# Altium schematic sheet FQDMDSchematic.SchDoc (part 3 of 3)
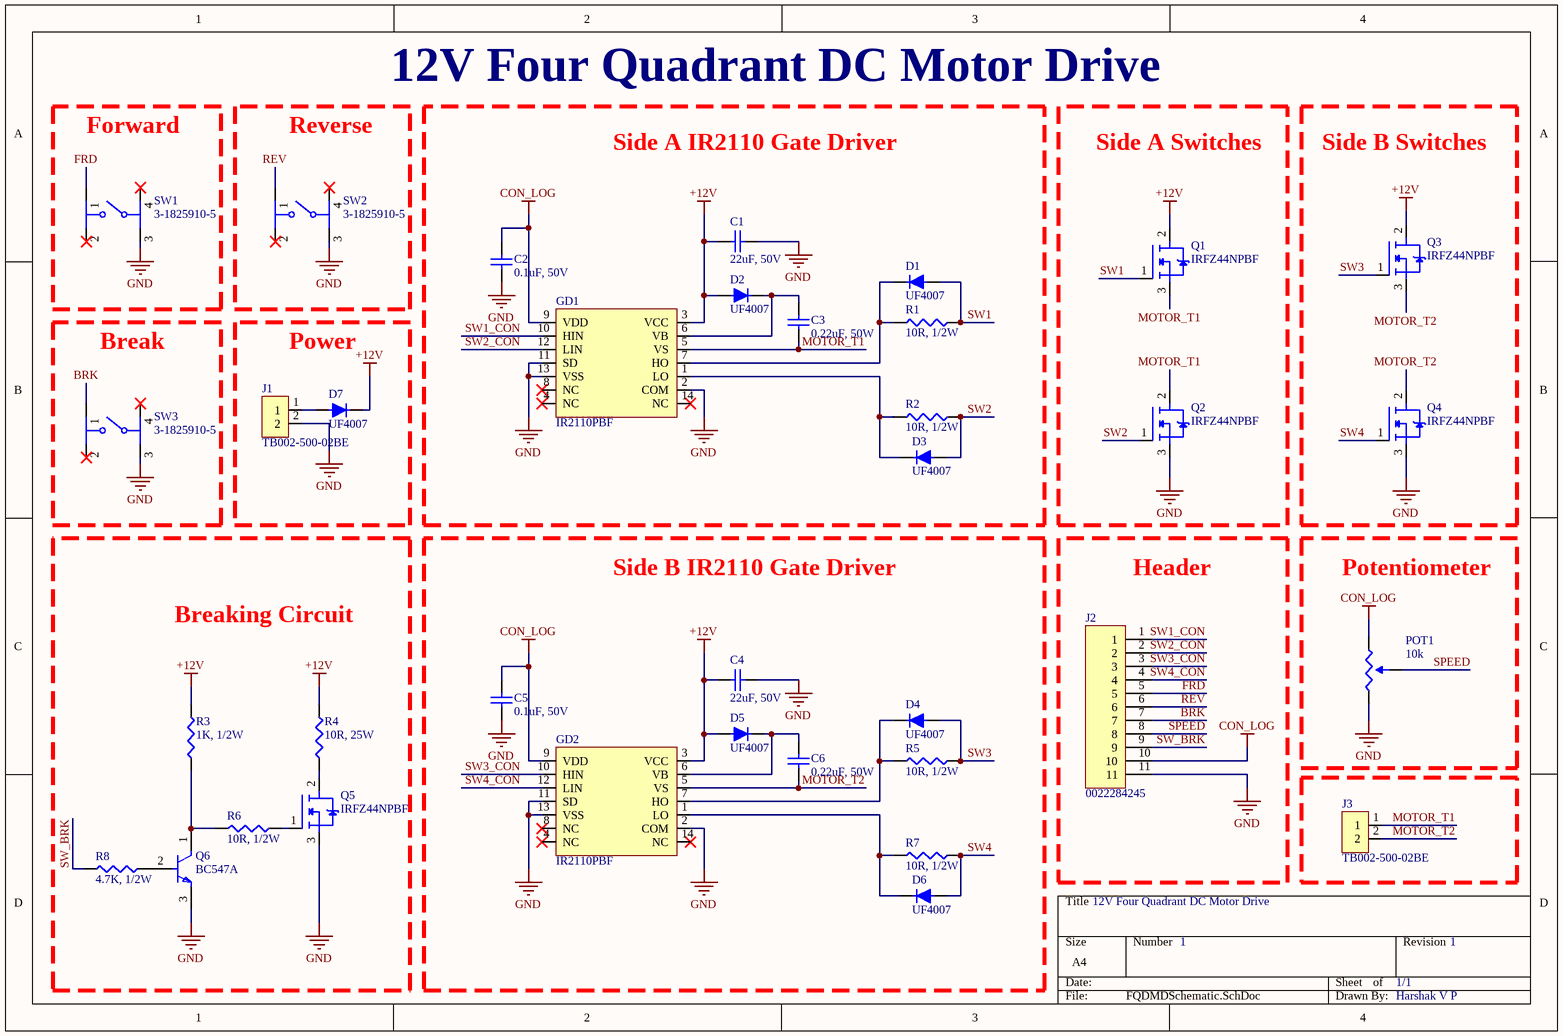
[diagram p2: FQDMDSchematic.SchDoc]

## Library data of the parts (continued)
R4 = KAL25FB10R0: RES CHAS MNT 10 OHM 1% 25W; Manufacturer: Stackpole Electronics; Lead/Base Style: Solder; Value: 10Ω; Temperature Coefficient: 30ppm/°C; Supplier: DigiKey; Supplier Part Number: KAL25FB10R0-ND; Manufacturer Part Number: KAL25FB10R0; RoHS: Compliant; Category: Chassis Mount Resistors; Stock: 500; Pricing: 1=5.22, 10=3.546, 25=3.092, 50=2.8076, 100=2.5658, 250=2.30096, 500=2.1353, 1000=1.99459, 5000=1.75 (USD); Composition: Wirewound; Features: Moisture Resistant; Height: 13.87mm; Housing Material: Aluminium; Length: 26.97mm; Lifecycle Status: Production; Max Operating Temperature: 275°C; Max Power Dissipation: 25W; Min Operating Temperature: -55°C; Mounting Technology: Chassis Mount; Number of Terminals: 2; Packaging: Bulk; Power Rating: 25W; Radiation Hardening: No; REACH SVHC: Yes; Tolerance: 1%; Width: 27.43mm; ComponentLink1URL: https://datasheet.octopart.com:443/KAL25FB10R0-Stackpole-Electronics-datasheet-170576574.pdf?src-supplier=IHS; ComponentLink1Description: https://datasheet.octopart.com:443/KAL25FB10R0-Stackpole-Electronics-datasheet-170576574.pdf?src-supplier=IHS; ComponentLink2URL: https://datasheet.octopart.com:443/KAL25FB10R0-Stackpole-Electronics-datasheet-137738308.pdf?src-supplier=Master+Electronics; ComponentLink2Description: https://datasheet.octopart.com:443/KAL25FB10R0-Stackpole-Electronics-datasheet-137738308.pdf?src-supplier=Master+Electronics; ComponentLink3URL: https://datasheet.octopart.com:443/KAL25FB10R0-Stackpole-Electronics-datasheet-163747744.pdf?src-supplier=Master+Electronics; ComponentLink3Description: https://datasheet.octopart.com:443/KAL25FB10R0-Stackpole-Electronics-datasheet-163747744.pdf?src-supplier=Master+Electronics; ComponentLink4URL: https://datasheet.octopart.com:443/KAL25FB10R0-Stackpole-Electronics-datasheet-32593518.pdf?src-supplier=Stackpole+Electronics; ComponentLink4Description: https://datasheet.octopart.com:443/KAL25FB10R0-Stackpole-Electronics-datasheet-32593518.pdf?src-supplier=Stackpole+Electronics; ComponentLink5URL: https://datasheet.octopart.com:443/KAL25FB10R0-Stackpole-Electronics-datasheet-17020207.pdf?src-supplier=Factory+Futures; ComponentLink5Description: https://datasheet.octopart.com:443/KAL25FB10R0-Stackpole-Electronics-datasheet-17020207.pdf?src-supplier=Factory+Futures; ComponentLink6URL: http://sigma.octopart.com:80/141158211/reach_statement/Stackpole-Electronics-KAL25FB10R0.pdf?src-supplier=Compliance+Statements; ComponentLink6Description: http://sigma.octopart.com:80/141158211/reach_statement/Stackpole-Electronics-KAL25FB10R0.pdf?src-supplier=Compliance+Statements; ComponentLink7URL: http://sigma.octopart.com:80/141158212/rohs_statement/Stackpole-Electronics-KAL25FB10R0.pdf?src-supplier=Compliance+Statements; ComponentLink7Description: http://sigma.octopart.com:80/141158212/rohs_statement/Stackpole-Electronics-KAL25FB10R0.pdf?src-supplier=Compliance+Statements
R8 = CFR-50JT-52-4K7: RES 4.7K OHM 5% 1/2W AXIAL; Manufacturer: Yageo Group; Lead Diameter: 550µm; Power Rating: 500mW; Value: 4.7kΩ; Temperature Coefficient: 350ppm/°C; Working Voltage: 350V; Supplier: DigiKey; Supplier Part Number: 13-CFR-50JT-52-4K7CT-ND; Manufacturer Part Number: CFR-50JT-52-4K7; RoHS: Compliant; Category: Through-Hole Resistors; Stock: 9950; Pricing: 1=0.1, 10=0.05, 25=0.0416, 50=0.0364, 100=0.032, 250=0.0272, 500=0.02418 (USD); Case/Package: Conformal; China RoHS: Compliant; Composition: Carbon Film; Contact Plating: Tin; Country of Origin: Mainland China, Taiwan; Diameter: 3.3mm; Export Control Classification Number (ECCN) Code: EAR99; Harmonized Tariff Schedule (HTS) Code: 8533.10.00.65; Introduction Date: 2007-10-26; Lead Free: Lead Free; Length: 9mm; Lifecycle Status: Production; Max Operating Temperature: 155°C; Military Standard: Not; Min Operating Temperature: -55°C; Mounting Technology: Through Hole; Number of Terminals: 2; Radiation Hardening: No; Ratings: AEC-Q200; REACH SVHC: Yes; Termination: Axial; Tolerance: 5%; ComponentLink1URL: https://datasheet.octopart.com:443/CFR-50JT-52-4K7-Yageo-datasheet-175860721.pdf?src-supplier=Newark; ComponentLink1Description: https://datasheet.octopart.com:443/CFR-50JT-52-4K7-Yageo-datasheet-175860721.pdf?src-supplier=Newark; ComponentLink2URL: https://datasheet.octopart.com:443/CFR-50JT-52-4K7-Yageo-datasheet-12509909.pdf?src-supplier=_legacy+Avnet; ComponentLink2Description: https://datasheet.octopart.com:443/CFR-50JT-52-4K7-Yageo-datasheet-12509909.pdf?src-supplier=_legacy+Avnet; ComponentLink3URL: https://datasheet.octopart.com:443/CFR-50JT-52-4K7-Yageo-Group-datasheet-184398216.pdf?src-supplier=Future+Electronics; ComponentLink3Description: https://datasheet.octopart.com:443/CFR-50JT-52-4K7-Yageo-Group-datasheet-184398216.pdf?src-supplier=Future+Electronics; ComponentLink4URL: https://datasheet.octopart.com:443/CFR-50JT-52-4K7-Yageo-datasheet-165493773.pdf?src-supplier=Future+Electronics; ComponentLink4Description: https://datasheet.octopart.com:443/CFR-50JT-52-4K7-Yageo-datasheet-165493773.pdf?src-supplier=Future+Electronics; ComponentLink5URL: https://datasheet.octopart.com:443/CFR-50JT-52-4K7-Yageo-datasheet-155367611.pdf?src-supplier=Future+Electronics; ComponentLink5Description: https://datasheet.octopart.com:443/CFR-50JT-52-4K7-Yageo-datasheet-155367611.pdf?src-supplier=Future+Electronics; ComponentLink6URL: https://datasheet.octopart.com:443/CFR-50JT-52-4K7-Yageo-datasheet-137875058.pdf?src-supplier=Future+Electronics; ComponentLink6Description: https://datasheet.octopart.com:443/CFR-50JT-52-4K7-Yageo-datasheet-137875058.pdf?src-supplier=Future+Electronics; ComponentLink7URL: https://datasheet.octopart.com:443/CFR-50JT-52-4K7-Yageo-datasheet-28066625.pdf?src-supplier=Future+Electronics; ComponentLink7Description: https://datasheet.octopart.com:443/CFR-50JT-52-4K7-Yageo-datasheet-28066625.pdf?src-supplier=Future+Electronics; ComponentLink8URL: https://datasheet.octopart.com:443/CFR-50JT-52-4K7-Yageo-datasheet-17276704.pdf?src-supplier=Future+Electronics; ComponentLink8Description: https://datasheet.octopart.com:443/CFR-50JT-52-4K7-Yageo-datasheet-17276704.pdf?src-supplier=Future+Electronics; ComponentLink9URL: http://sigma.octopart.com:80/conflict_mineral_statement/Yageo-company-3.pdf?src-supplier=Compliance+Statements; ComponentLink9Description: http://sigma.octopart.com:80/conflict_mineral_statement/Yageo-company-3.pdf?src-supplier=Compliance+Statements; ComponentLink10URL: http://sigma.octopart.com:80/rohs_statement/Yageo-company-2.pdf?src-supplier=Compliance+Statements; ComponentLink10Description: http://sigma.octopart.com:80/rohs_statement/Yageo-company-2.pdf?src-supplier=Compliance+Statements
SW1-SW3 = 3-1825910-5: SWITCH TACTILE SPST-NO 0.05A 24V; Manufacturer: TE Connectivity; Manufacturer Lifecycle Status: ACTIVE; Actuator Length: 4.9mm; Actuator Material: Nylon, Polyamide; Contact Current Rating: 50mA; Contact Resistance: 100mΩ; Electrical Life: 100kcycles; Illumination Type: Illuminated, Non-Illuminated; Number of Positions: 1; Operating Force: 1.568N; Switch Function: Off-Mom; Switch Travel: 250µm; Throw Configuration: SPST; Supplier: DigiKey; Supplier Part Number: 450-1644-ND; Manufacturer Part Number: 3-1825910-5; RoHS: Compliant; Category: Pushbutton Switches; Stock: 31248; Pricing: 1=0.16, 10=0.144, 25=0.1348, 100=0.1213, 250=0.1126, 750=0.10273, 1500=0.09697, 3000=0.09163, 5250=0.08765 (USD); China RoHS: Compliant; Color: Black; Contact Material: Silver; Contact Plating: Silver; Current Rating: 50mA; Export Control Classification Number (ECCN) Code: EAR99; ELV: Compliant; Height: 3.61mm; Housing Material: Nylon; Harmonized Tariff Schedule (HTS) Code: 8536.50.90.40; Introduction Date: 2008-01-30; Lead Free: Lead Free; Length: 5.99mm; Lifecycle Status: Production; Max Current Rating: 50mA; Max Operating Temperature: 85°C; Max Voltage Rating (DC): 24V; Mechanical Life: 100kcycles; Min Operating Temperature: -35°C; Mounting Technology: PCB, Through Hole; Orientation: Straight; Packaging: Bulk; Radiation Hardening: No; REACH SVHC: Yes; Schedule B: 8536509065; Termination: Solder; Type: Switch; Voltage Rating (DC): 24V; ComponentLink1URL: https://sigma.octopart.com:443/101748000/technical_drawing/TE-Connectivity-3-1825910-5.pdf?src-supplier=Sager+Electronics; ComponentLink1Description: https://sigma.octopart.com:443/101748000/technical_drawing/TE-Connectivity-3-1825910-5.pdf?src-supplier=Sager+Electronics; ComponentLink2URL: https://datasheet.octopart.com:443/3-1825910-5-TE-Connectivity-datasheet-10294628.pdf?src-supplier=TE+Connectivity; ComponentLink2Description: https://datasheet.octopart.com:443/3-1825910-5-TE-Connectivity-datasheet-10294628.pdf?src-supplier=TE+Connectivity; ComponentLink3URL: https://datasheet.octopart.com:443/3-1825910-5-TE-Connectivity-datasheet-58177301.pdf?src-supplier=TE+Connectivity; ComponentLink3Description: https://datasheet.octopart.com:443/3-1825910-5-TE-Connectivity-datasheet-58177301.pdf?src-supplier=TE+Connectivity; ComponentLink4URL: https://sigma.octopart.com:443/12291753/technical_drawing/TE-Connectivity-3-1825910-5.pdf?src-supplier=Burklin+Elektronik; ComponentLink4Description: https://sigma.octopart.com:443/12291753/technical_drawing/TE-Connectivity-3-1825910-5.pdf?src-supplier=Burklin+Elektronik; ComponentLink5URL: https://datasheet.octopart.com:443/3-1825910-5-TE-Connectivity-datasheet-33009270.pdf?src-supplier=Newark; ComponentLink5Description: https://datasheet.octopart.com:443/3-1825910-5-TE-Connectivity-datasheet-33009270.pdf?src-supplier=Newark; ComponentLink6URL: https://datasheet.octopart.com:443/3-1825910-5-Tyco-Electronics-datasheet-10028384.pdf?src-supplier=Newark; ComponentLink6Description: https://datasheet.octopart.com:443/3-1825910-5-Tyco-Electronics-datasheet-10028384.pdf?src-supplier=Newark; ComponentLink7URL: https://datasheet.octopart.com:443/FSM18JH-Alcoswitch-datasheet-160371.pdf?src-supplier=Master+Electronics; ComponentLink7Description: https://datasheet.octopart.com:443/FSM18JH-Alcoswitch-datasheet-160371.pdf?src-supplier=Master+Electronics; ComponentLink8URL: https://datasheet.octopart.com:443/3-1825910-5-TE-Connectivity---AMP-datasheet-189108451.pdf?src-supplier=Master+Electronics; ComponentLink8Description: https://datasheet.octopart.com:443/3-1825910-5-TE-Connectivity---AMP-datasheet-189108451.pdf?src-supplier=Master+Electronics; ComponentLink9URL: https://datasheet.octopart.com:443/3-1825910-5-TE-Connectivity-datasheet-145421083.pdf?src-supplier=RS+(Formerly+Allied+Electronics); ComponentLink9Description: https://datasheet.octopart.com:443/3-1825910-5-TE-Connectivity-datasheet-145421083.pdf?src-supplier=RS+(Formerly+Allied+Electronics); ComponentLink10URL: https://datasheet.octopart.com:443/FSM18JH-TE-Connectivity-datasheet-512274.pdf?src-supplier=RS+(Formerly+Allied+Electronics); ComponentLink10Description: https://datasheet.octopart.com:443/FSM18JH-TE-Connectivity-datasheet-512274.pdf?src-supplier=RS+(Formerly+Allied+Electronics); ComponentLink11URL: https://datasheet.octopart.com:443/3-1825910-5-TE-Connectivity-datasheet-165583917.pdf?src-supplier=TME; ComponentLink11Description: https://datasheet.octopart.com:443/3-1825910-5-TE-Connectivity-datasheet-165583917.pdf?src-supplier=TME; ComponentLink12URL: https://datasheet.octopart.com:443/3-1825910-5-TE-Connectivity---AMP-datasheet-27860381.pdf?src-supplier=Electro+Sonic; ComponentLink12Description: https://datasheet.octopart.com:443/3-1825910-5-TE-Connectivity---AMP-datasheet-27860381.pdf?src-supplier=Electro+Sonic; ComponentLink13URL: https://datasheet.octopart.com:443/3-1825910-5-Tyco-Electronics-datasheet-11788987.pdf?src-supplier=Arrow+Electronics; ComponentLink13Description: https://datasheet.octopart.com:443/3-1825910-5-Tyco-Electronics-datasheet-11788987.pdf?src-supplier=Arrow+Electronics; ComponentLink14URL: http://sigma.octopart.com:80/14574724/rohs_statement/TE-Connectivity-3-1825910-5.pdf?src-supplier=Compliance+Statements; ComponentLink14Description: http://sigma.octopart.com:80/14574724/rohs_statement/TE-Connectivity-3-1825910-5.pdf?src-supplier=Compliance+Statements